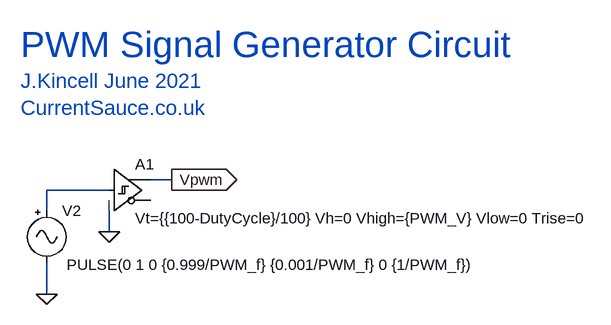
[diagram p0: schematic PWM_Gen.asc]
PWM_Gen.asc, the LTspice schematic file:
Version 4
SHEET 1 880 680
WIRE -1296 64 -1328 64
WIRE -1392 80 -1488 80
WIRE -1488 112 -1488 80
WIRE -1392 144 -1392 112
WIRE -1488 240 -1488 192
FLAG -1488 240 0
FLAG -1296 64 Vpwm
IOPIN -1296 64 Out
FLAG -1392 144 0
SYMBOL Misc\\signal -1488 96 R0
WINDOW 123 0 0 Left 0
WINDOW 39 0 0 Left 0
WINDOW 3 31 99 Left 2
SYMATTR Value PULSE(0 1 0 {0.999/PWM_f} {0.001/PWM_f} 0 {1/PWM_f})
SYMATTR InstName V2
SYMBOL Digital\\schmitt -1392 16 R0
WINDOW 3 40 107 Left 2
SYMATTR Value Vt={{100-DutyCycle}/100} Vh=0 Vhigh={PWM_V} Vlow=0 Trise=0
SYMATTR InstName A1
TEXT -1528 -144 Left 5 ;PWM Signal Generator Circuit
TEXT -1528 -88 Left 3 ;J.Kincell June 2021\nCurrentSauce.co.uk

The netlist it stands for:
* PWM_Gen.asc
V2 N001 0 PULSE(0 1 0 {0.999/PWM_f} {0.001/PWM_f} 0 {1/PWM_f})
A1 N001 0 0 0 0 0 Vpwm 0 SCHMITT Vt={{100-DutyCycle}/100} Vh=0 Vhigh={PWM_V} Vlow=0 Trise=0
* PWM Signal Generator Circuit
* J.Kincell June 2021
* CurrentSauce.co.uk
.backanno
.end